# EAGLE design rev2 (EAGLE 6.5.0)
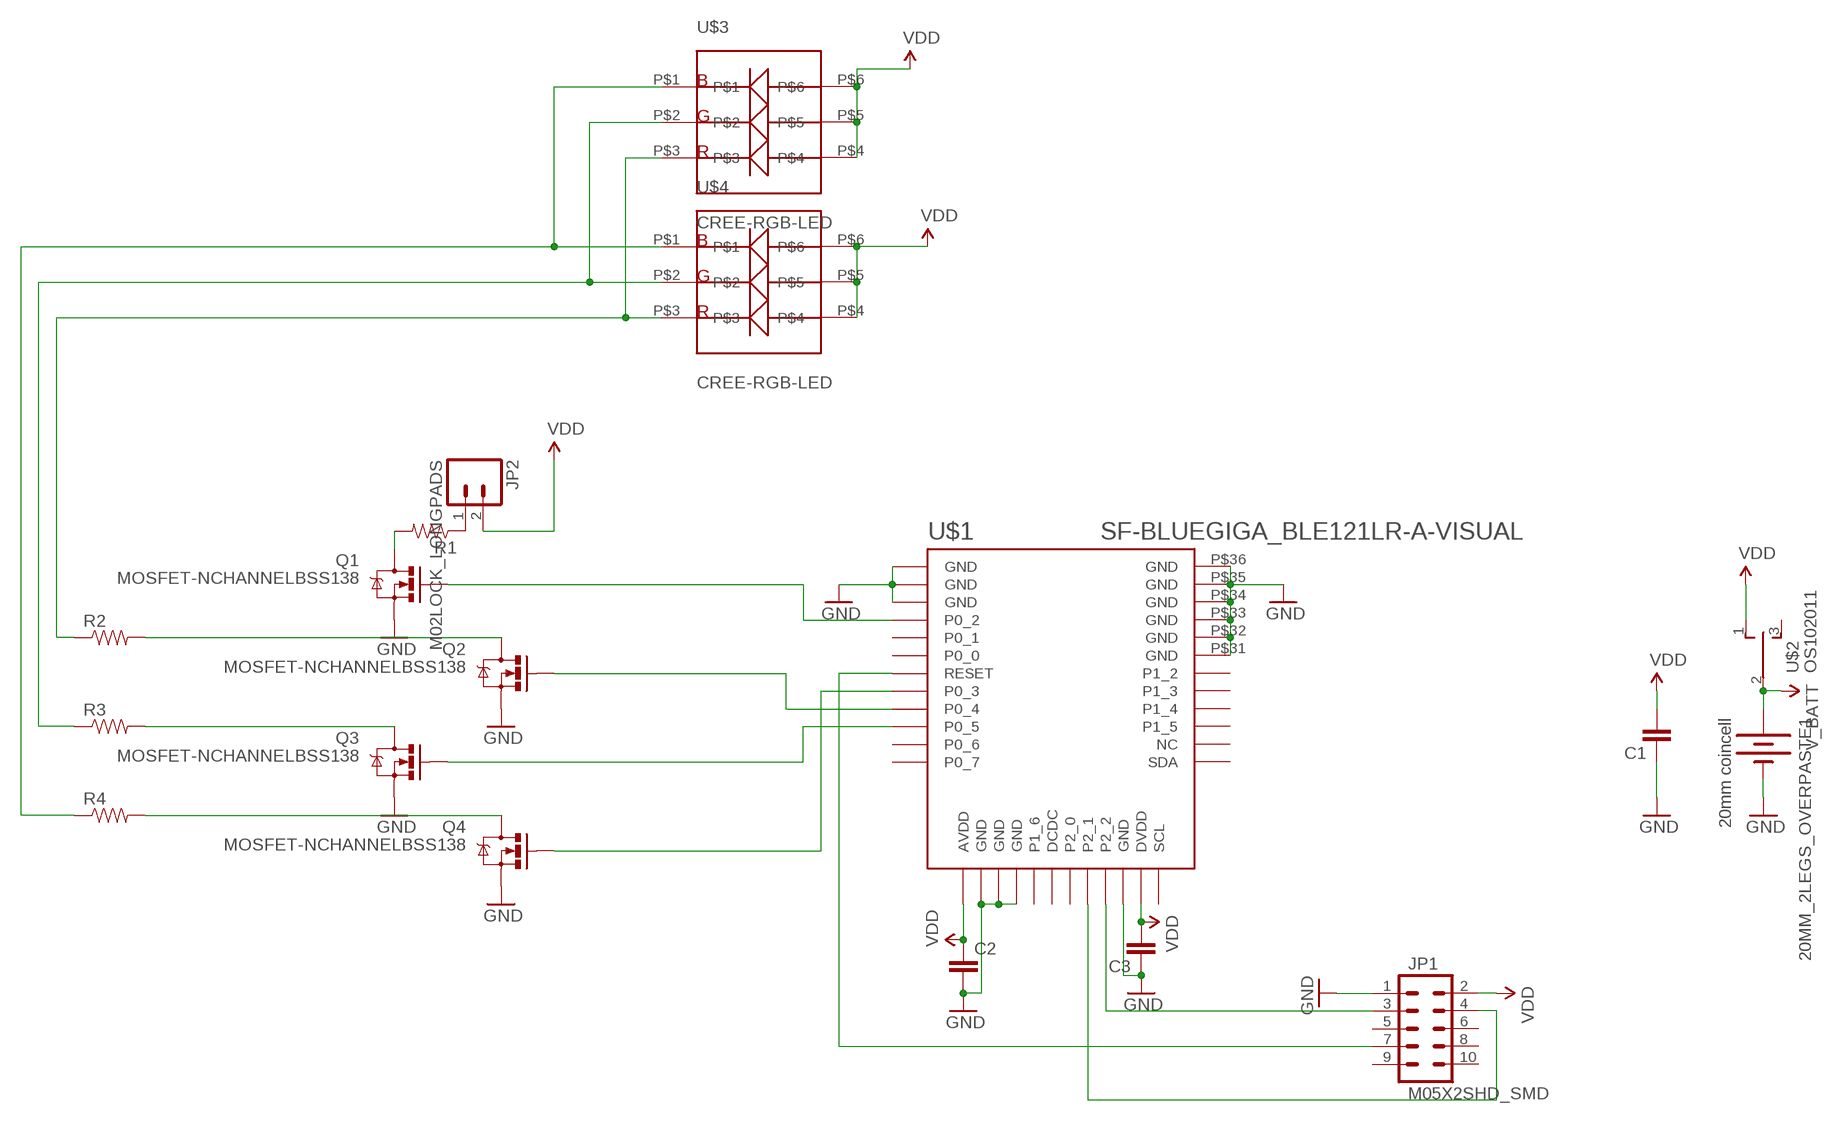
[diagram p0: schematic, sheet 1]

## Parts
20MM_2LEGS_OVERPASTE1  20mm coincell  BATTERY20MM_4LEGS  [BATTCON_20MM_4LEGS]
C1  CAP1206  [1206]
C2  CAP0603-CAP  [0603-CAP]
C3  CAP0603-CAP  [0603-CAP]
JP1  M05X2SHD_SMD  [2X5-SHROUDED_SMD]
JP2  M02LOCK_LONGPADS  [1X02_LOCK_LONGPADS]
Q1  MOSFET-NCHANNELBSS138  [SOT23-3]
Q2  MOSFET-NCHANNELBSS138  [SOT23-3]
Q3  MOSFET-NCHANNELBSS138  [SOT23-3]
Q4  MOSFET-NCHANNELBSS138  [SOT23-3]
R1  RESISTOR0603  [0603-RES]
R2  RESISTOR0603  [0603-RES]
R3  RESISTOR0603  [0603-RES]
R4  RESISTOR0603  [0603-RES]
U$1  SF-BLUEGIGA_BLE121LR-A-VISUAL  [SF-BLUEGIGA_BLE121LR-A]
U$2  OS102011  [OS102011]
U$3  CREE-RGB-LED  [CREE-RGB-LED]
U$4  CREE-RGB-LED  [CREE-RGB-LED]

## Nets
GND: 20MM_2LEGS_OVERPASTE1.2(-) C1.1 C2.2 C3.1 JP1.1 Q1.2(S) Q2.2(S) Q3.2(S) Q4.2(S) U$1.P$1(GND) U$1.P$2(GND) U$1.P$3(GND) U$1.P$14(GND) U$1.P$15(GND) U$1.P$16(GND) U$1.P$22(GND) U$1.P$31(GND) U$1.P$32(GND) U$1.P$33(GND) U$1.P$34(GND) U$1.P$35(GND) U$1.P$36(GND)
N$1: Q1.3(D) R1.2
N$2: Q2.3(D) R2.2
N$3: Q3.3(D) R3.2
N$4: Q4.3(D) R4.2
N$5: Q4.1(G) U$1.P$8(P0_3)
N$6: Q3.1(G) U$1.P$10(P0_5)
N$7: Q2.1(G) U$1.P$9(P0_4)
N$8: Q1.1(G) U$1.P$4(P0_2)
N$9: JP2.1 R1.1
N$10: R2.1 U$3.P$3 U$4.P$3
N$11: R3.1 U$3.P$2 U$4.P$2
N$12: JP1.3 U$1.P$21(P2_2)
N$13: JP1.4 U$1.P$20(P2_1)
N$14: JP1.7 U$1.P$7(RESET)
N$15: R4.1 U$3.P$1 U$4.P$1
V_BATT: 20MM_2LEGS_OVERPASTE1.1(+) U$2.2(P)
VDD: C1.2 C2.1 C3.2 JP1.2 JP2.2 U$1.P$13(AVDD) U$1.P$23(DVDD) U$2.1(O) U$3.P$4 U$3.P$5 U$3.P$6 U$4.P$4 U$4.P$5 U$4.P$6
Unconnected: JP1.5 JP1.6 JP1.8 JP1.9 JP1.10 U$1.P$5(P0_1) U$1.P$6(P0_0) U$1.P$11(P0_6) U$1.P$12(P0_7) U$1.P$17(P1_6) U$1.P$18(DCDC) U$1.P$19(P2_0) U$1.P$24(SCL) U$1.P$25(SDA) U$1.P$26(NC) U$1.P$27(P1_5) U$1.P$28(P1_4) U$1.P$29(P1_3) U$1.P$30(P1_2) U$2.3(S)

## Library data of the parts
20MM_2LEGS_OVERPASTE1 = bluetipz:BATTERY: Battery Holders Various common sizes : AA, AAA, 20mm coin cell and 12mm coin cell. 20MM_4LEGS, BATT-10373; PROD_ID: BATT-10373
C1-C3 = SparkFun-Capacitors:CAP: Capacitor Standard 0603 ceramic capacitor, and 0.1" leaded capacitor.
JP1 = SparkFun-Connectors:M05X2: Header 5x2 Standard 10-pin dual row 0.1" header. Commonly used with AVR-ISP. Use with Spark Fun Electronics SKU: PRT-00778
JP2 = SparkFun-Connectors:M02: Standard 2-pin 0.1" header. Use with - straight break away headers ( PRT-00116) - right angle break away headers (PRT-00553) - swiss pins (PRT-00743) - machine pins (PRT-00117) - female headers (PRT-00115) Molex polarized connector foot print use with: PRT-08233 with associated crimp pins and housings. 2.54_SCREWTERM for use with PRT-10571. 3.5mm Screw Terminal footprints for PRT-08084 5mm Screw Terminal footprints for use with PRT-08432
Q1-Q4 = SparkFun-DiscreteSemi:MOSFET-NCHANNEL: Common NMOSFET Parts MFG P/N Store ID Prod ID FDD8780 TRANS-09984 SI7820DN TRANS-11055 FDS6630A IC-08089 2N7002PW TRANS-11151 FQP30N06L COM-10213 TRANS-10060 BSS123LT1G TRANS-08345 BSS138 TRANS-00830 BS170 2N7000; PROD_ID: TRANS-00830
R1-R4 = SparkFun-Resistors:RESISTOR: Resistor Basic schematic elements and footprints for 0603, 1206, and PTH resistors.
U$1 = bluetipz:SF-BLUEGIGA_BLE121LR-A-VISUAL
U$2 = bluetipz:OS102011
U$3 U$4 = bike_lo_jack:CREE-RGB-LED

## Board
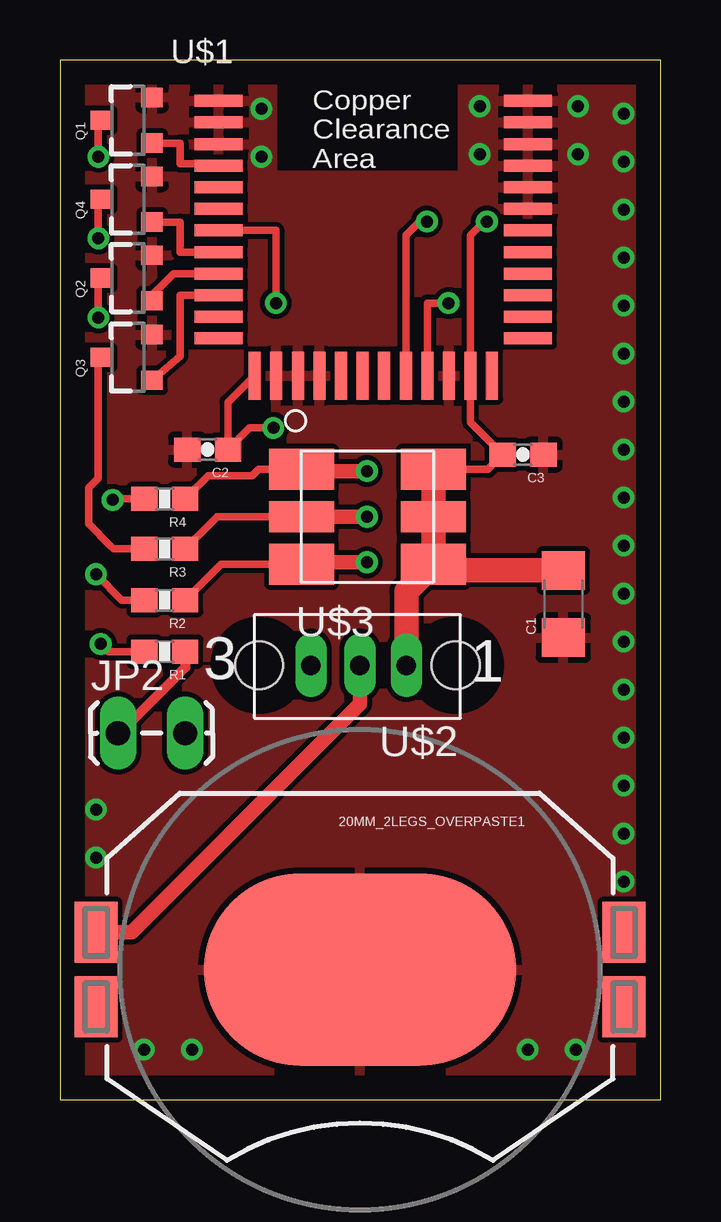
[diagram p1: board, top side]
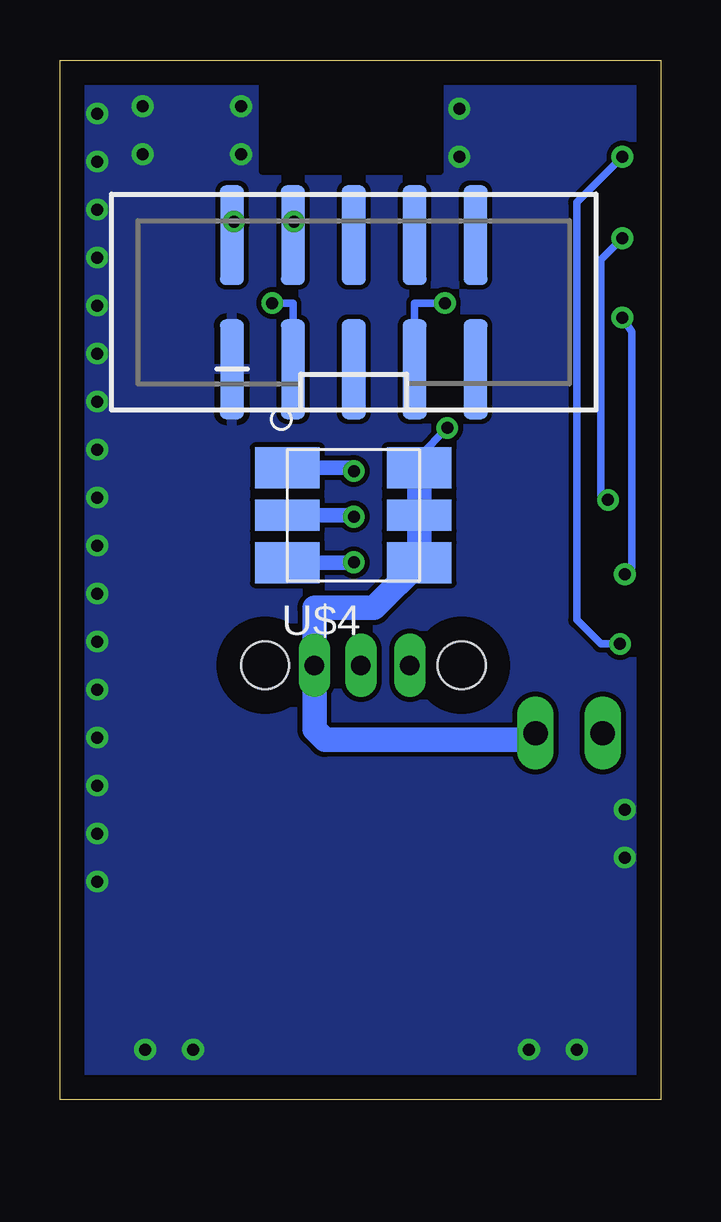
[diagram p2: board, bottom side, seen from below]

Size 25.05 x 43.33 mm. Coordinates in mm from the lower left corner, seen from the top.
Outline: 0,0 25.05,0 25.05,43.33 0,43.33 0,0
Copper layers (1*16): Top 0.035mm / dielectric 1.5mm / Bottom 0.035mm
Design rules "default": minimum track width 10mil, minimum drill 24mil, track to track 8mil, track to pad 8mil, pad to pad 8mil, via to via 8mil, smd to smd 8mil, copper to edge 40mil, drill to drill 8mil, minimum pad ring 10mil, minimum via ring 8mil, stop-mask expansion 4mil, vias tented up to drill 0mil, thermal gap 10mil

### Footprints (pad centres in the part's own frame; a part is rotated, then mirrored left to right if it is on the bottom)
BATTCON_20MM_4LEGS = smd 1.778 x 2.54: 1 -11,1.55; 3 11,1.55; P$1 -11,-1.55; P$2 11,-1.55 | smd 13 x 8: 2 0,0
1206 = smd 1.6 x 1.8: 1 -1.4,0; 2 1.4,0
0603-CAP = smd 1.1 x 1: 1 -0.85,0; 2 0.85,0
2X5-SHROUDED_SMD = smd 4.15 x 1: 1 -2.794,5.08; 2 2.794,5.08; 3 -2.794,2.54; 4 2.794,2.54; 5 -2.794,0; 6 2.794,0; 7 -2.794,-2.54; 8 2.794,-2.54; 9 -2.794,-5.08; 10 2.794,-5.08
1X02_LOCK_LONGPADS = drill 1.016 long: 1 -0.127,0; 2 2.667,0
SOT23-3 = smd 0.8 x 0.9: 1 -0.95,-1; 2 0.95,-1; 3 0,1.1
0603-RES = smd 1.1 x 1: 1 -0.85,0; 2 0.85,0
SF-BLUEGIGA_BLE121LR-A = smd 2 x 0.5: P$1 2,13.45; P$2 2,12.55; P$3 2,11.65; P$4 2,10.75; P$5 2,9.85; P$6 2,8.95; P$7 2,8.05; P$8 2,7.15; P$9 2,6.25; P$10 2,5.35; P$11 2,4.45; P$12 2,3.55; P$25 14.9,3.55; P$26 14.9,4.45; P$27 14.9,5.35; P$28 14.9,6.25; P$29 14.9,7.15; P$30 14.9,8.05; P$31 14.9,8.95; P$32 14.9,9.85; P$33 14.9,10.75; P$34 14.9,11.65; P$35 14.9,12.55; P$36 14.9,13.45 | smd 0.5 x 2: P$13 3.5,2; P$14 4.4,2; P$15 5.3,2; P$16 6.2,2; P$17 7.1,2; P$18 8,2; P$19 8.9,2; P$20 9.8,2; P$21 10.7,2; P$22 11.6,2; P$23 12.5,2; P$24 13.4,2
OS102011 = drill 0.813 long: 1 2.26,2.1; 2 4.2,2.1; 3 6.24,2.1 | hole 2: 0.2,2.1; 8.4,2.1
CREE-RGB-LED = smd 2.7 x 1.7: P$1 -2.75,1.975; P$3 -2.75,-1.975; P$4 2.75,-1.975; P$6 2.75,1.975 | smd 2.7 x 1.3: P$2 -2.75,0; P$5 2.75,0

### Placement (x,y rotation side)
20MM_2LEGS_OVERPASTE1  12.51,5.43 0 top
C1  20.99,20.66 90 top
C2  6.16,27.1 180 top
C3  19.31,26.89 180 top
JP1  12.8,33.24 90 bottom
JP2  2.55,15.28 0 top
Q1  2.84,40.82 90 top
Q2  2.84,34.25 90 top
Q3  2.84,30.94 90 top
Q4  2.84,37.53 90 top
R1  4.37,18.68 180 top
R2  4.37,20.82 180 top
R3  4.37,22.96 180 top
R4  4.37,25.04 180 top
U$1  4.62,28.18 0 top
U$2  16.7,20.21 180 top
U$3  12.82,24.3 0 top
U$4  12.82,24.36 0 bottom

### Tracks (layer width: path | path; a pad name or v marks a point on that pad's centre or on a via)
GND  (via drill 0.5)
  other vias: 8.4,39.3 8.4,41.3 17.5,39.4 17.5,41.4 21.6,39.4 21.6,41.4 23.5,41.1 23.5,39.1 23.5,37.1 23.5,35.1 23.5,33.1 23.5,31.1 23.5,29.1 23.5,27.1 23.5,25.1 23.5,23.1 23.5,21.1 23.5,19.1 23.5,17.1 23.5,15.1 23.5,13.1 23.5,11.1 23.5,9.1 21.5,2.1 19.5,2.1 5.5,2.1 3.5,2.1 1.5,10.1 1.5,12.1
  pour Bottom: 0,0 25,0 25,45 0,45
  pour Top: 0,0 25,0 25,45 0,45
N$1  (via drill 0.5)
  Top 0.305: Q1.3 1.6,40.68 v1.6,39.3 | v1.7,19 2.02,18.68 R1.2
  Bottom 0.305: v1.6,39.3 3.5,37.4 3.5,20 2.5,19 v1.7,19
N$2  (via drill 0.5)
  Top 0.305: Q2.3 1.6,34.11 v1.6,32.6 | R2.2 2.58,20.82 v1.5,21.9
  Bottom 0.305: v1.6,32.6 1.2,32 1.2,26 1.2,23.1 1.2,22.2 v1.5,21.9
N$3
  Top 0.305: Q3.3 1.6,30.8 1.6,29.3 1.6,25.9 1.2,25.5 1.2,24 2.1,23.1 2.24,22.96 R3.2
N$4  (via drill 0.5)
  Top 0.305: Q4.3 1.6,37.39 v1.6,35.9 | v2.2,25 2.04,25.04 R4.2
  Bottom 0.305: v1.6,35.9 2.5,35 2.5,25.2 2.3,25 v2.2,25
N$5
  Top 0.305: Q4.1 5,36.58 5,35.4 5,35.33 U$1.P$8
N$6
  Top 0.305: Q3.1 5,30.99 5,33.4 5,33.53 U$1.P$10
N$7
  Top 0.305: 3.84,33.43 Q2.1 3.84,33.54 4.4,34.1 4.73,34.43 U$1.P$9
N$8
  Top 0.305: Q1.1 5,39.87 5,39 6.62,39 U$1.P$4
N$9
  Top 0.406: R1.1 5.22,18.02 4.3,17.1 2.48,15.28 JP2.1
N$10  (via drill 0.5)
  Top 0.305: R2.1 6.72,22.32 U$3.P$3
  Top 0.61: U$3.P$3 10.14,22.4 v12.8,22.4
  Bottom 0.61: v12.8,22.4 12.81,22.39 U$4.P$3
N$11  (via drill 0.5)
  Top 0.305: R3.1 6.56,24.3 U$3.P$2
  Top 0.61: U$3.P$2 v12.8,24.3
  Bottom 0.61: v12.8,24.3 12.76,24.36 U$4.P$2
N$12  (via drill 0.5)
  Top 0.305: v16.2,33.2 15.32,33.2 U$1.P$21
  Bottom 0.305: JP1.3 15.34,33.2 v16.2,33.2
N$13  (via drill 0.5)
  Top 0.305: U$1.P$20 14.42,36.03 14.99,36.6 v15.3,36.6
  Bottom 0.305: v15.3,36.6 15.34,36.56 JP1.4
  Bottom 0.61: JP1.4
N$14  (via drill 0.5)
  Top 0.305: U$1.P$7 9,36.23 v9,33.2
  Bottom 0.305: v9,33.2 10.26,33.2 JP1.7
N$15  (via drill 0.5)
  Top 0.305: R4.1 6.18,26 8,26 8.28,26.27 U$3.P$1
  Top 0.61: U$3.P$1 10.14,26.2 v12.8,26.2
  Bottom 0.61: v12.8,26.2 12.94,26.34 U$4.P$1
N$17
  cutout Bottom: 9.2,42.1 16.6,42.1 16.6,38.7 9.2,38.7
V_BATT
  Top 0.61: 20MM_2LEGS_OVERPASTE1.1 2.98,6.98 8,12 12.5,16.5 U$2.2
VDD  (via drill 0.5)
  Top 0.305: U$1.P$13 7.01,29.07 C2.1 7.91,28 v8.9,28 | U$3.P$6 17.84,26.27 C3.2 17.12,28.23 U$1.P$23 17.12,36.03 17.69,36.6 v17.8,36.6
  Top 1.016: U$3.P$6 U$3.P$5 U$3.P$4 | U$3.P$4 14.44,21.2 U$2.1 | C1.2 15.57,22.06 U$3.P$4
  Bottom 0.305: v8.9,28 10.07,26.83 U$4.P$6 | v17.8,36.6 17.88,36.58 JP1.2
  Bottom 1.016: U$4.P$6 U$4.P$5 U$4.P$4 11.96,20.5 14.44,20.5 U$2.1 14.44,15.44 14,15 5.5,15 JP2.2